# EAGLE design test (EAGLE 7.6.0)
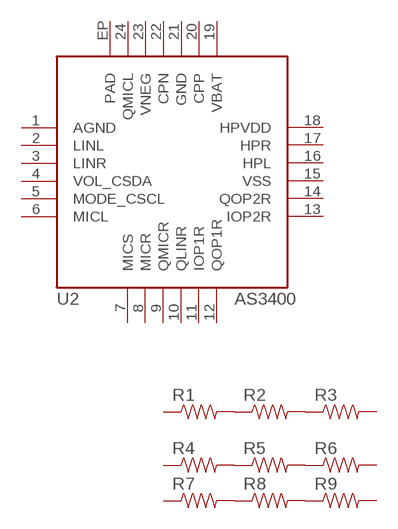
[diagram p0: schematic, sheet 1]

## Parts
R1  RESISTOR0805-RES  [0805]
R2  RESISTOR0805-RES  [0805]
R3  RESISTOR0805-RES  [0805]
R4  RESISTOR0603-RES  [0603-RES]
R5  RESISTOR0603-RES  [0603-RES]
R6  RESISTOR0603-RES  [0603-RES]
R7  RESISTOR0402-RES  [0402-RES]
R8  RESISTOR0402-RES  [0402-RES]
R9  RESISTOR0402-RES  [0402-RES]
U2  AS3400  [QFN-24_ALT2]

## Nets
N$1: R1.2 R2.1
N$2: R2.2 R3.1
N$3: R4.2 R5.1
N$4: R5.2 R6.1
N$5: R7.2 R8.1
N$6: R8.2 R9.1
Unconnected: R1.1 R3.2 R4.1 R6.2 R7.1 R9.2 U2.1(AGND) U2.2(LINL) U2.3(LINR) U2.4(VOL_CSDA) U2.5(MODE_CSCL) U2.6(MICL) U2.7(MICS) U2.8(MICR) U2.9(QMICR) U2.10(QLINR) U2.11(IOP1R) U2.12(QOP1R) U2.13(IOP2R) U2.14(QOP2R) U2.15(VSS) U2.16(HPL) U2.17(HPR) U2.18(HPVDD) U2.19(VBAT) U2.20(CPP) U2.21(GND) U2.22(CPN) U2.23(VNEG) U2.24(QMICL) U2.EP(PAD)

## Library data of the parts
R1-R9 = SparkFun-Passives:RESISTOR: Resistor Basic schematic elements and footprints for 0603, 1206, and PTH resistors.
U2 = SparkFun-AnalogIC:AS3400: Active noise cancellation chip. Stereo in, stereo out, two microphones. Single alkaline cell power. QFN-24 w/exposed pad.

## Board
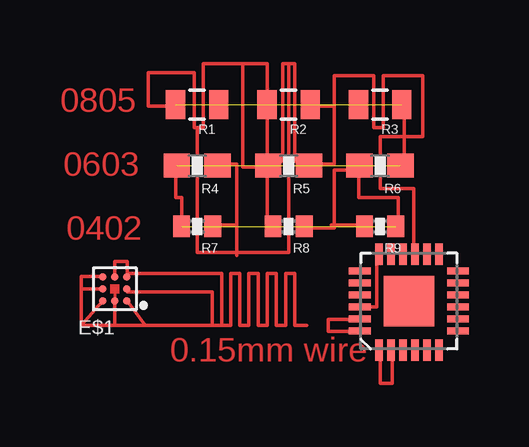
[diagram p1: board, top side]

No outline drawn. Coordinates in mm, seen from the top.
Copper layers (1*16): Top 0.035mm / dielectric 1.5mm / Bottom 0.035mm
Design rules "default": minimum track width 10mil, minimum drill 24mil, track to track 8mil, track to pad 8mil, pad to pad 8mil, via to via 8mil, smd to smd 8mil, copper to edge 40mil, drill to drill 8mil, minimum pad ring 10mil, minimum via ring 8mil, stop-mask expansion 4mil, vias tented up to drill 0mil, thermal gap 10mil

### Footprints (pad centres in the part's own frame; a part is rotated, then mirrored left to right if it is on the bottom)
BGA8DS = smd 0.305 x 0.305: A1 0.5,-0.5; A2 0,-0.5; A3 -0.5,-0.5; B1 0.5,0; B3 -0.5,0; C1 0.5,0.5; C2 0,0.5; C3 -0.5,0.5
0805 = smd 0.8 x 1.2: 1 -0.9,0; 2 0.9,0
0603-RES = smd 1.1 x 1: 1 -0.85,0; 2 0.85,0
0402-RES = smd 0.7 x 0.9: 1 -0.65,0; 2 0.65,0
QFN-24_ALT2 = smd 0.9 x 0.3: 1 -2.05,1.25; 2 -2.05,0.75; 3 -2.05,0.25; 4 -2.05,-0.25; 5 -2.05,-0.75; 6 -2.05,-1.25; 13 1.95,-1.25; 14 1.95,-0.75; 15 1.95,-0.25; 16 1.95,0.25; 17 1.95,0.75; 18 1.95,1.25 | smd 0.3 x 0.9: 7 -1.25,-2.05; 8 -0.75,-2.05; 9 -0.25,-2.05; 10 0.25,-2.05; 11 0.75,-2.05; 12 1.25,-2.05; 19 1.25,2.05; 20 0.75,2.05; 21 0.25,2.05; 22 -0.25,2.05; 23 -0.75,2.05; 24 -1.25,2.05 | smd 2.1 x 2.1: EP 0,0

### Placement (x,y rotation side)
E$1  [BGA8DS]  1.52,22.35 0 top
R1  4.95,30.04 180 top
R2  8.76,30.04 180 top
R3  12.57,30.04 180 top
R4  4.95,27.5 180 top
R5  8.76,27.5 180 top
R6  12.57,27.5 180 top
R7  4.95,24.96 180 top
R8  8.76,24.96 180 top
R9  12.57,24.96 180 top
U2  13.78,21.84 90 top

### Tracks (layer width: path | path; a pad name or v marks a point on that pad's centre or on a via)
N$1  (1 unrouted)
N$2  (1 unrouted)
N$3  (1 unrouted)
N$4  (1 unrouted)
N$5  (1 unrouted)
N$6  (1 unrouted)
N$7
  Top 0.15: 3.94,29.97 2.92,29.97 2.92,31.37 4.83,31.37 4.83,29.08 4.95,29.08 | 4.95,29.08 5.21,29.08 5.21,31.75 6.86,31.75 | 6.86,31.75 7.87,31.75 7.87,27.69 8.51,27.69 8.51,31.75 8.76,31.75 | 8.76,31.75 9.02,31.75 9.02,27.69 9.65,27.69 | 4.95,29.08 4.95,23.88 8.76,23.88 8.76,31.75 | 8,27.43 7.87,27.43 | 7.87,27.43 6.86,27.43 6.86,31.75 | 8.26,24.89 7.87,24.89 7.87,27.43
N$8
  Top 0.15: 9.78,29.97 10.67,29.97 | 10.67,29.97 10.67,31.24 12.32,31.24 12.32,29.08 12.7,29.08 12.7,31.24 14.35,31.24 14.35,28.7 13.59,28.7 | 9.65,27.56 10.67,27.56 10.67,29.97 | 13.46,27.43 13.59,27.43 13.59,28.7 | 13.59,28.7 13.59,30.1 | 13.59,28.7 12.57,28.7 12.57,26.54 13.97,26.54 13.97,23.5
N$9
  Top 0.15: 5.84,27.56 6.6,27.56 6.6,25.02 | 6.6,25.02 6.6,23.75 | 5.46,25.02 6.6,25.02
N$10
  Top 0.15: 11.56,27.3 10.67,27.3 10.67,24.89 9.4,24.89
N$11
  Top 0.15: 10.54,25.02 11.94,25.02 11.94,24.89
N$12
  Top 0.15: 13.21,25.02 13.34,25.02 13.34,26.16 11.68,26.16 11.68,27.43
N$14
  Top 0.15: 5.97,20.83 5.97,22.99 2.03,22.99 2.03,23.5 1.52,23.5 1.52,22.86 | 5.97,20.83 6.35,20.83 6.35,22.99 6.73,22.99 6.73,20.83 7.11,20.83 7.11,22.99 7.49,22.99 7.49,20.83 7.87,20.83 7.87,22.99 8.26,22.99 8.26,20.83 8.64,20.83 8.64,22.99 9.02,22.99 9.02,20.83 9.53,20.83 | 2.03,22.23 5.59,22.23 5.59,20.83 | 5.59,20.83 5.97,20.83 | 1.02,22.86 0.13,22.86 0.13,22.35 | 0.13,22.35 0.13,20.83 | 0.13,20.83 1.52,20.83 | 1.52,20.83 2.79,20.83 | 2.79,20.83 5.59,20.83 | 1.02,22.35 0.13,22.35 | 1.52,21.84 1.52,20.83 | 1.02,21.84 0.13,20.83 | 2.03,21.84 2.79,20.83
N$15
  Top 0.15: 12.57,19.81 12.57,18.41 13.08,18.41 13.08,19.81
N$16
  Top 0.15: 11.81,21.08 10.41,21.08 10.41,20.57 11.68,20.57
N$17
  Top 0.15: 11.56,21.59 12.45,21.59 12.45,23.75
S$1
  Top 0.15: 4.06,27.56 4.06,26.16 4.32,26.16 4.32,25.02

### Text on the board
Top: 0805 | 0603 | 0402 | 0.15mm wire